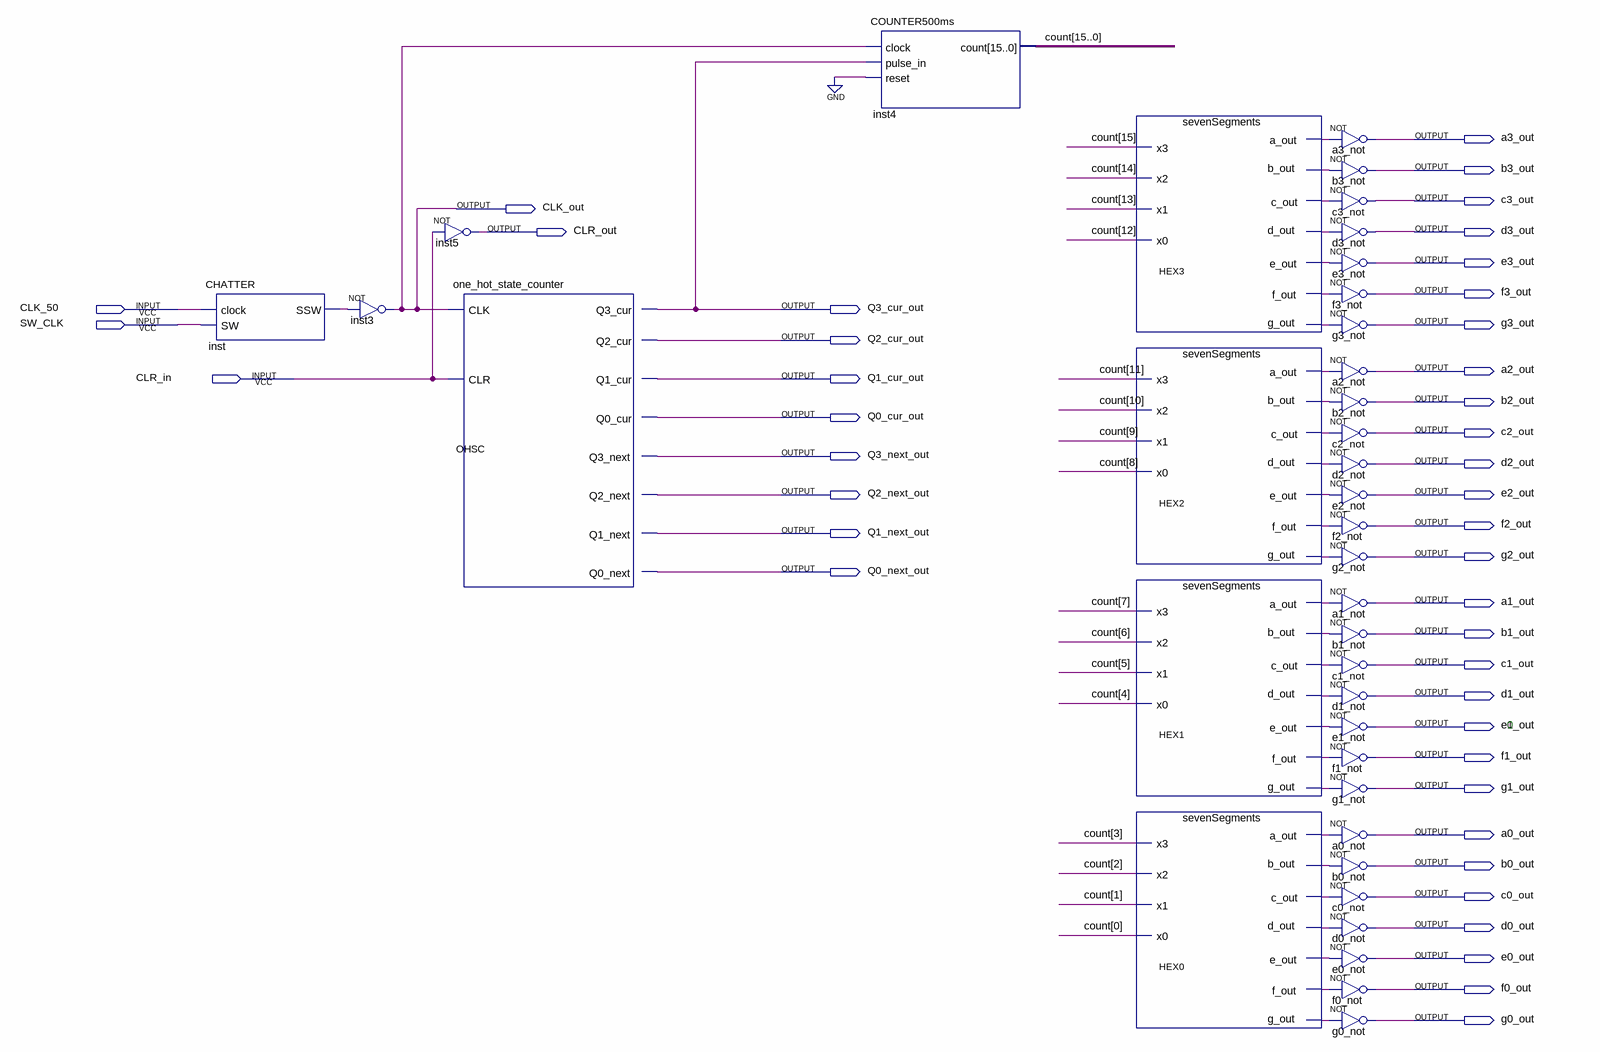
[diagram p0: schematic sheet]
// Quartus schematic OHSC_interface.bdf as structural Verilog: 37 symbols, 41 pins
module OHSC_interface (
  input  CLK_50,
  input  SW_CLK,
  input  CLR_in,
  output a3_out,
  output b3_out,
  output c3_out,
  output CLK_out,
  output CLR_out,
  output d3_out,
  output e3_out,
  output f3_out,
  output Q3_cur_out,
  output g3_out,
  output Q2_cur_out,
  output a2_out,
  output Q1_cur_out,
  output b2_out,
  output Q0_cur_out,
  output c2_out,
  output Q3_next_out,
  output d2_out,
  output Q2_next_out,
  output e2_out,
  output f2_out,
  output Q1_next_out,
  output g2_out,
  output Q0_next_out,
  output a1_out,
  output b1_out,
  output c1_out,
  output d1_out,
  output e1_out,
  output f1_out,
  output g1_out,
  output a0_out,
  output b0_out,
  output c0_out,
  output d0_out,
  output e0_out,
  output f0_out,
  output g0_out
);

  wire HEX0_a_out, HEX0_b_out, HEX0_c_out, HEX0_d_out, HEX0_e_out, HEX0_f_out, HEX0_g_out, HEX1_a_out,
       HEX1_b_out, HEX1_c_out, HEX1_d_out, HEX1_e_out, HEX1_f_out, HEX1_g_out, HEX2_a_out, HEX2_b_out,
       HEX2_c_out, HEX2_d_out, HEX2_e_out, HEX2_f_out, HEX2_g_out, HEX3_a_out, HEX3_b_out, HEX3_c_out,
       HEX3_d_out, HEX3_e_out, HEX3_f_out, HEX3_g_out, inst_ssw;
  wire [15:0] count;

  CHATTER inst (.clock(CLK_50), .SW(SW_CLK), .SSW(inst_ssw));
  not inst3 (CLK_out, inst_ssw);
  not inst5 (CLR_out, CLR_in);
  one_hot_state_counter OHSC (
    .CLK(CLK_out), .CLR(CLR_in), .Q3_cur(Q3_cur_out), .Q2_cur(Q2_cur_out), .Q1_cur(Q1_cur_out),
    .Q0_cur(Q0_cur_out), .Q3_next(Q3_next_out), .Q2_next(Q2_next_out), .Q1_next(Q1_next_out),
    .Q0_next(Q0_next_out));
  COUNTER500ms inst4 (.clock(CLK_out), .pulse_in(Q3_cur_out), .reset(1'b0), .count(count));
  sevenSegments HEX3 (
    .x3(count[15]), .x2(count[14]), .x1(count[13]), .x0(count[12]), .a_out(HEX3_a_out), .b_out(HEX3_b_out),
    .c_out(HEX3_c_out), .d_out(HEX3_d_out), .e_out(HEX3_e_out), .f_out(HEX3_f_out), .g_out(HEX3_g_out));
  sevenSegments HEX2 (
    .x3(count[11]), .x2(count[10]), .x1(count[9]), .x0(count[8]), .a_out(HEX2_a_out), .b_out(HEX2_b_out),
    .c_out(HEX2_c_out), .d_out(HEX2_d_out), .e_out(HEX2_e_out), .f_out(HEX2_f_out), .g_out(HEX2_g_out));
  sevenSegments HEX1 (
    .x3(count[7]), .x2(count[6]), .x1(count[5]), .x0(count[4]), .a_out(HEX1_a_out), .b_out(HEX1_b_out),
    .c_out(HEX1_c_out), .d_out(HEX1_d_out), .e_out(HEX1_e_out), .f_out(HEX1_f_out), .g_out(HEX1_g_out));
  sevenSegments HEX0 (
    .x3(count[3]), .x2(count[2]), .x1(count[1]), .x0(count[0]), .a_out(HEX0_a_out), .b_out(HEX0_b_out),
    .c_out(HEX0_c_out), .d_out(HEX0_d_out), .e_out(HEX0_e_out), .f_out(HEX0_f_out), .g_out(HEX0_g_out));
  not a3_not (a3_out, HEX3_a_out);
  not b3_not (b3_out, HEX3_b_out);
  not c3_not (c3_out, HEX3_c_out);
  not d3_not (d3_out, HEX3_d_out);
  not e3_not (e3_out, HEX3_e_out);
  not f3_not (f3_out, HEX3_f_out);
  not g3_not (g3_out, HEX3_g_out);
  not a2_not (a2_out, HEX2_a_out);
  not b2_not (b2_out, HEX2_b_out);
  not c2_not (c2_out, HEX2_c_out);
  not d2_not (d2_out, HEX2_d_out);
  not e2_not (e2_out, HEX2_e_out);
  not f2_not (f2_out, HEX2_f_out);
  not g2_not (g2_out, HEX2_g_out);
  not a1_not (a1_out, HEX1_a_out);
  not b1_not (b1_out, HEX1_b_out);
  not c1_not (c1_out, HEX1_c_out);
  not d1_not (d1_out, HEX1_d_out);
  not e1_not (e1_out, HEX1_e_out);
  not f1_not (f1_out, HEX1_f_out);
  not g1_not (g1_out, HEX1_g_out);
  not a0_not (a0_out, HEX0_a_out);
  not b0_not (b0_out, HEX0_b_out);
  not c0_not (c0_out, HEX0_c_out);
  not d0_not (d0_out, HEX0_d_out);
  not e0_not (e0_out, HEX0_e_out);
  not f0_not (f0_out, HEX0_f_out);
  not g0_not (g0_out, HEX0_g_out);

  // Notes on the sheet:
  //   0
endmodule
